# EAGLE schematic Nixie Boost Converter (EAGLE 9.0.0)
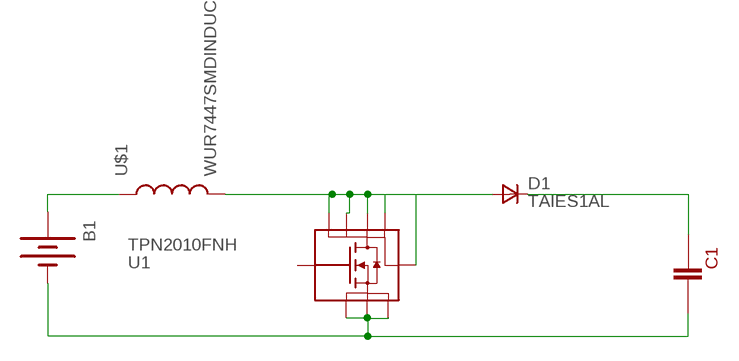
[diagram p0: schematic, sheet 1]

## Parts
B1  2.1BARRELJACK  [2.1BARRELJACK]
C1  NICHICONUUX2ECAP  [NICUUX2E]
D1  TAIES1AL  [TAIES1AL]
U1  TPN2010FNH  [TSONADVANCE]
U$1  WUR7447SMDINDUCT  [WUR7447IND]

## Nets
N$1: B1.POS U$1.P$1
N$2: U1.D$1 U$1.P$2
N$3: U1.D$2 U1.D$3 U1.D$4
N$4: D1.A$1(A) U1.D$0
N$5: C1.POS D1.C$1(C)
N$6: B1.GND$1(GND) C1.NEG U1.S$1 U1.S$2 U1.S$3
Unconnected: U1.G$1

## Library data of the parts
B1 = Booster Parts:2.1BARRELJACK: 2.1 mm x 5.5 mm Barrel Jack Specifications: Manufacturer: Memory Protection Devices Voltage - Rated: 12 VDC Current Rating: 5A Datasheet: EJ508A <http://www.memoryprotectiondevices.com/datasheets/EJ508A-datasheet.pdf> Digikey Part #: EJ508A-ND <https://www.digikey.com/products/en?keywords=EJ508A>
C1 = Booster Parts:NICHICONUUX2ECAP: Nichicon UUX2E Capacitor: SMD Capacitor Specification: Manufacturer: Nichicon Series: UUX Tolerance: 20% Voltage Rating: 250V Dimension: 10.3 mm x 10.3 mm Datasheet: UUX Series <http://nichicon-us.com/english/products/pdfs/e-uux.pdf> Digikey Part #: 493-9980-1-ND <https://www.digikey.com/product-detail/en/nichicon/UUX2E100MNL1GS/493-9980-1-ND/3974089>
D1 = Booster Parts:TAIES1AL: Taiwan ES1FL R3G: SMD 300V Diode Specification: Manufacturer: Taiwan Semiconductor Corporation Max Reverse Voltage: 300V Max I: 1A Datasheet: ES1AL-ES1JL <http://www.taiwansemi.com/products/datasheet/ES1AL%20SERIES_K15.pdf> Digikey Part #: ES1FLR3GCT-ND <https://www.digikey.com/product-detail/en/taiwan-semiconductor-corporation/ES1FL-R3G/ES1FLR3GCT-ND/7357444>
U1 = Booster Parts:TPN2010FNH: Toshiba TPN2010FNH: SMD NMOS Mosfet Specifications: Manufacturer: Toshiba Vdss: 250V Max Current: 5.6A Vgs (Max): 20V Datasheet: TPN2010FNH <https://toshiba.semicon-storage.com/info/docget.jsp?did=14597&prodName=TPN2010FNH> Digikey Product #: TPN2010FNHL1QCT-ND <https://www.digikey.com.au/product-detail/en/toshiba-semiconductor-and-storage/TPN2010FNHL1Q/TPN2010FNHL1QCT-ND/4815264>
U$1 = Booster Parts:WUR7447SMDINDUCT: Wurth Electronics Inductors - 7447709681: SMD Inductor Specifications: Manufacturer: Wurth Electronics Inc. Series: WE-PD Type: Wirewound Mounting Type: SMD Datasheet: 7447709681 <http://katalog.we-online.de/pbs/datasheet/7447709681.pdf> Digikey Part #: 732-1700-1-ND <https://www.digikey.com/product-detail/en/wurth-electronics-inc/7447709681/732-1700-1-ND/1994280>